# EasyEDA schematic SCH_cnc3018_upgrade_2024-04-28.json

## Sheets
1 Mainboard_Schematic: TITLE: Sheet_1; REV: 1.0; Date: 2024-04-21; Sheet: 1/1; Company: Your Company
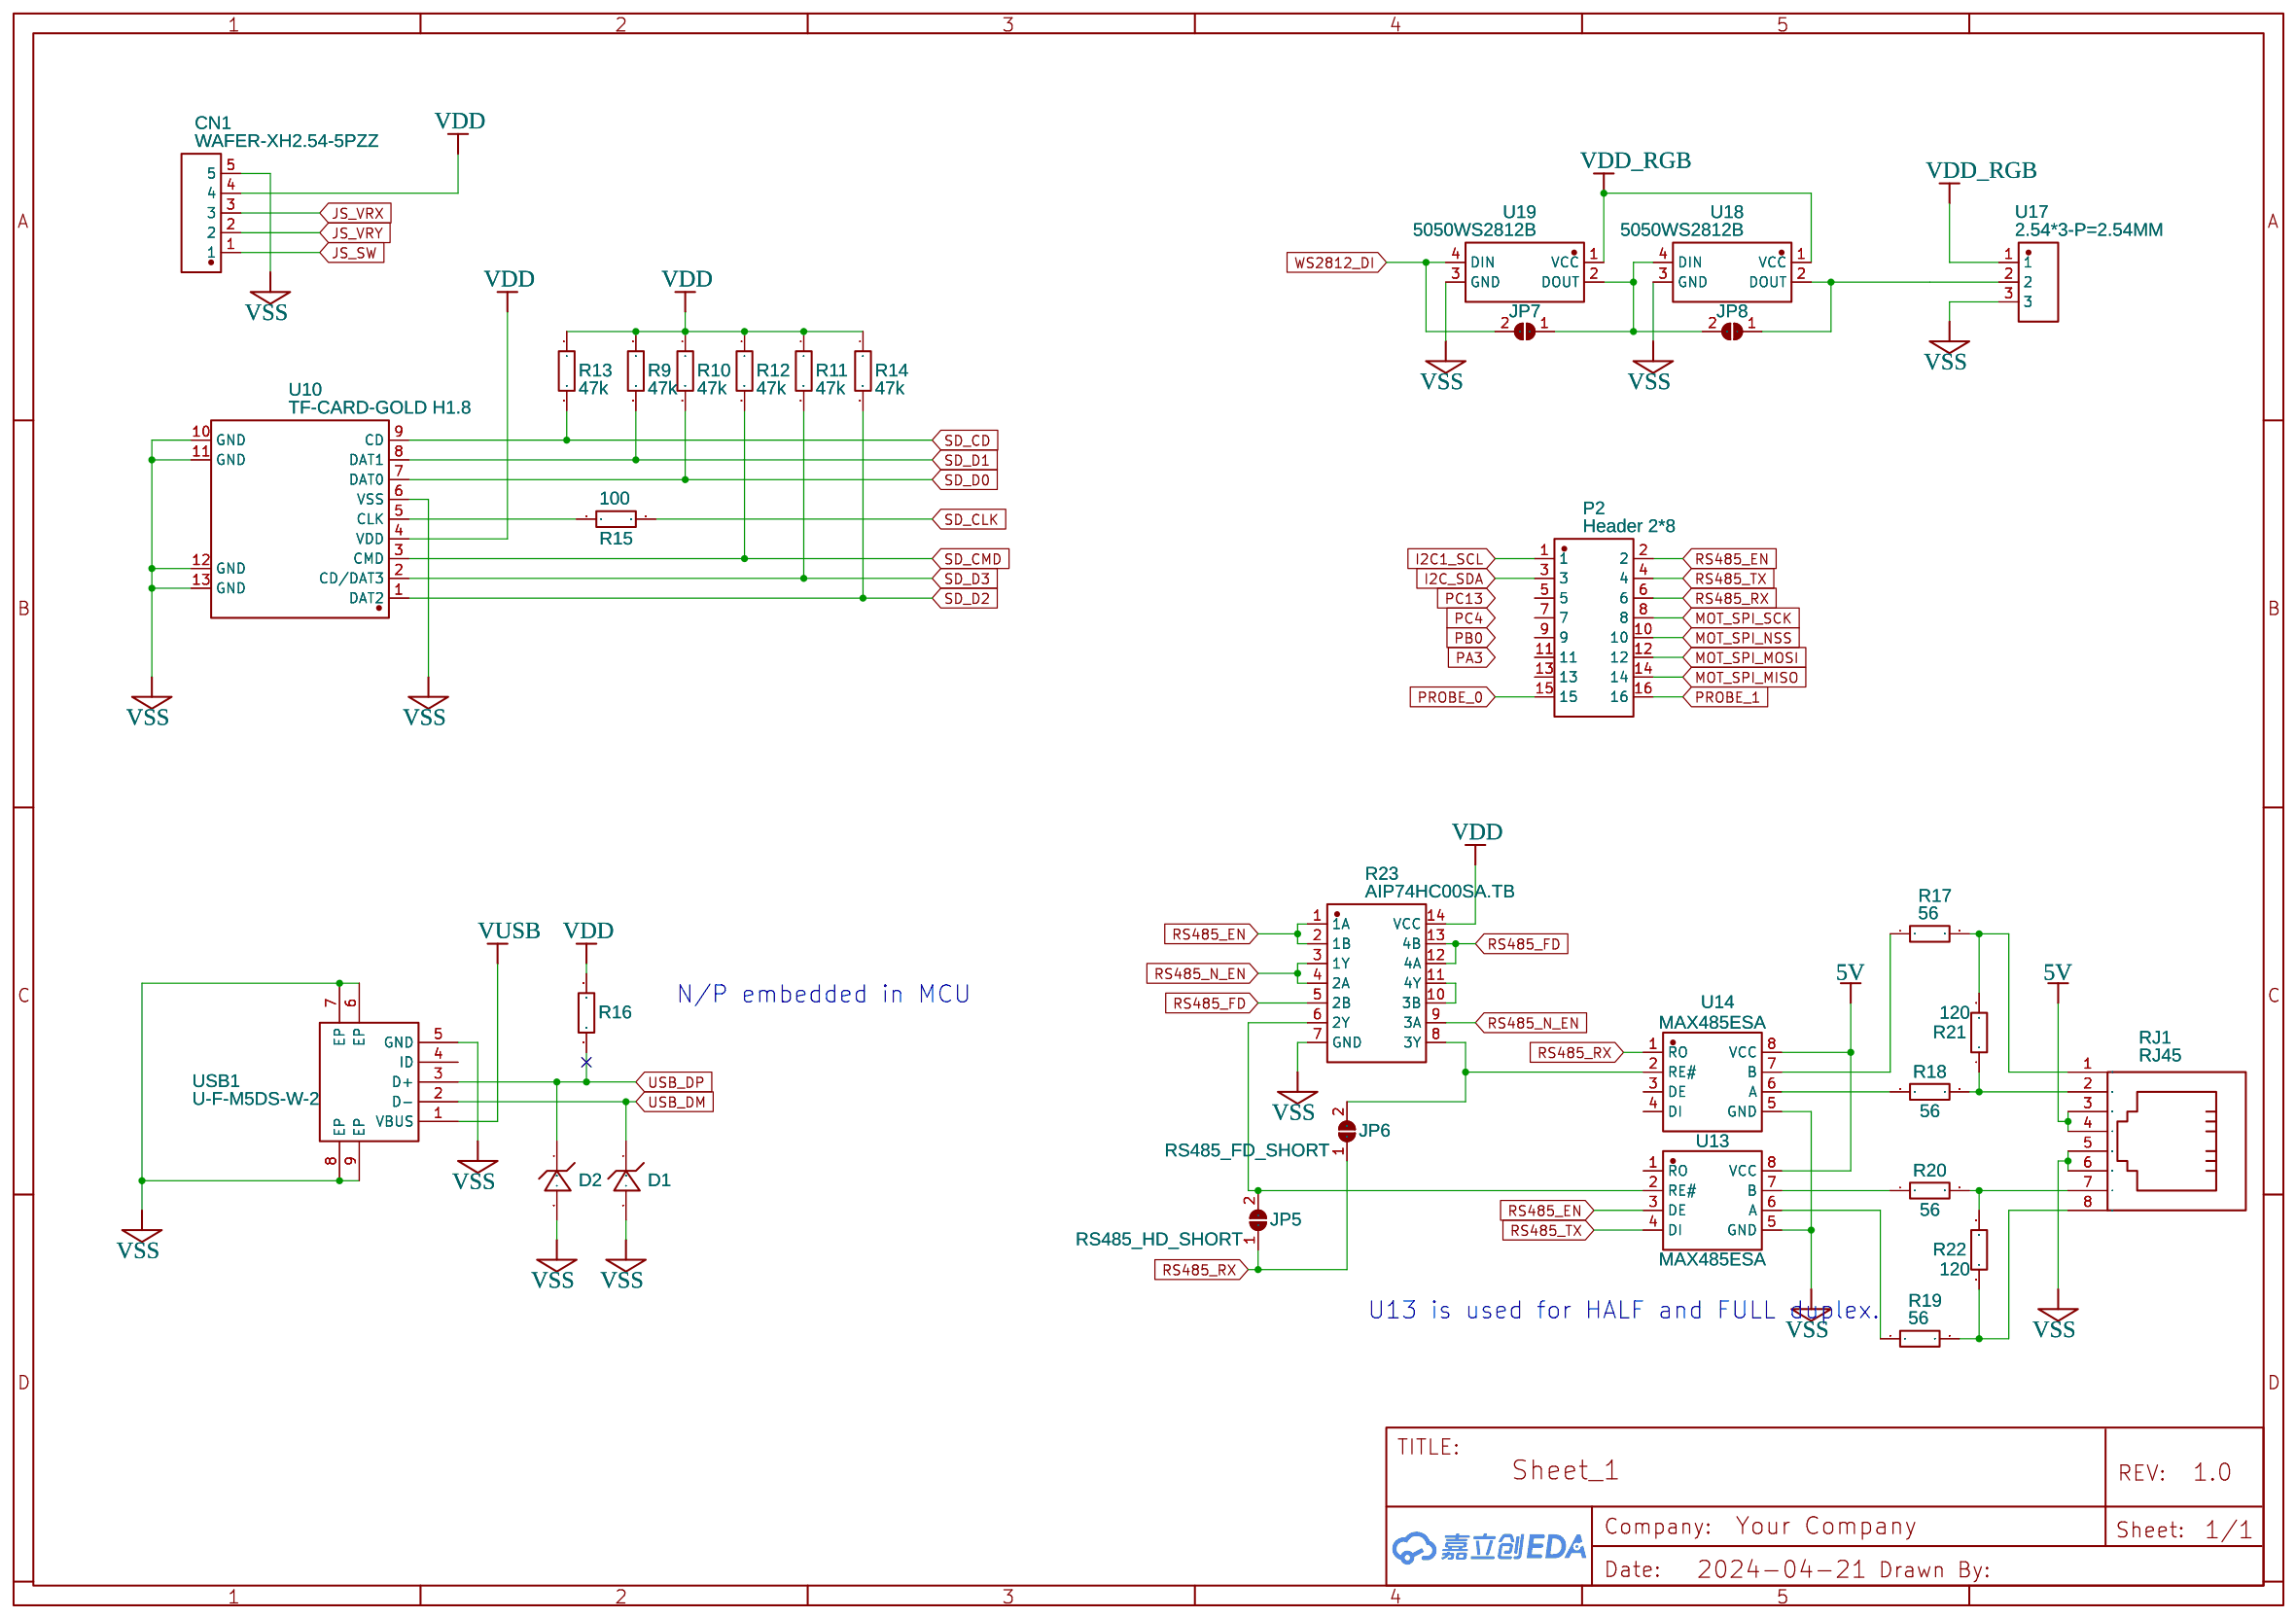
[diagram p0: Mainboard_Schematic]
2 MotorControl
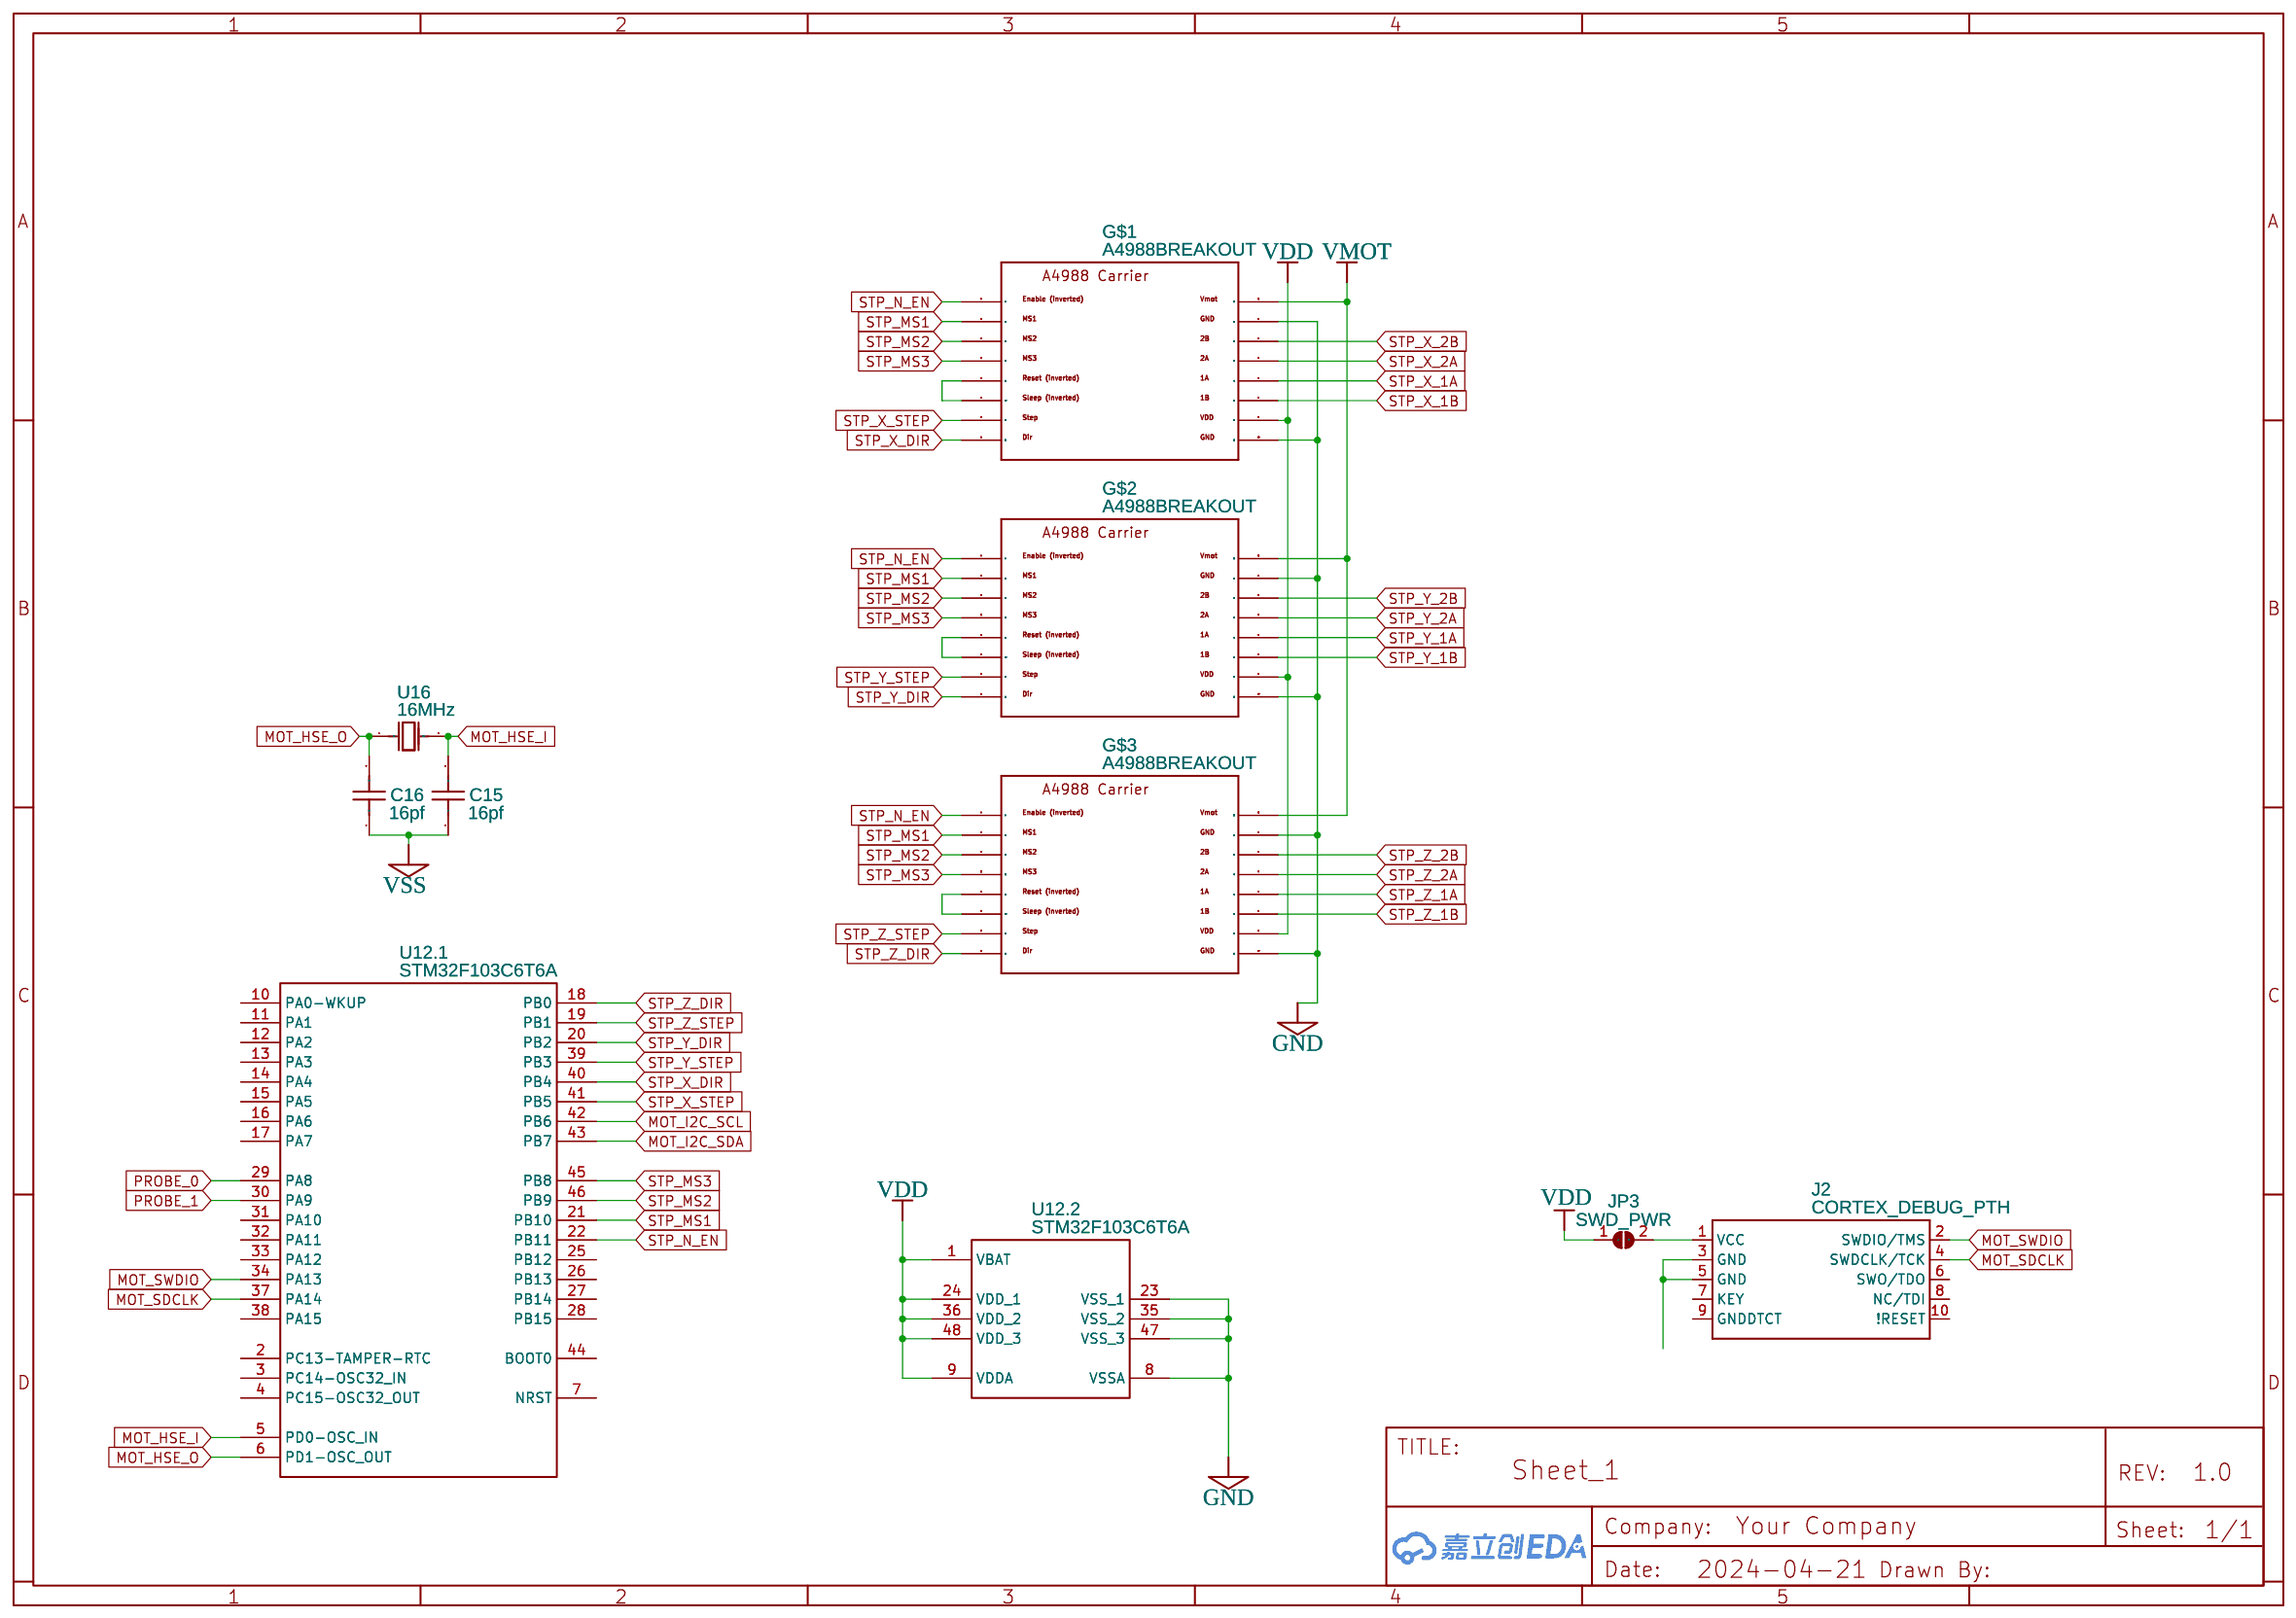
[diagram p1: MotorControl]
3 Processor: Date: 2024-04-22
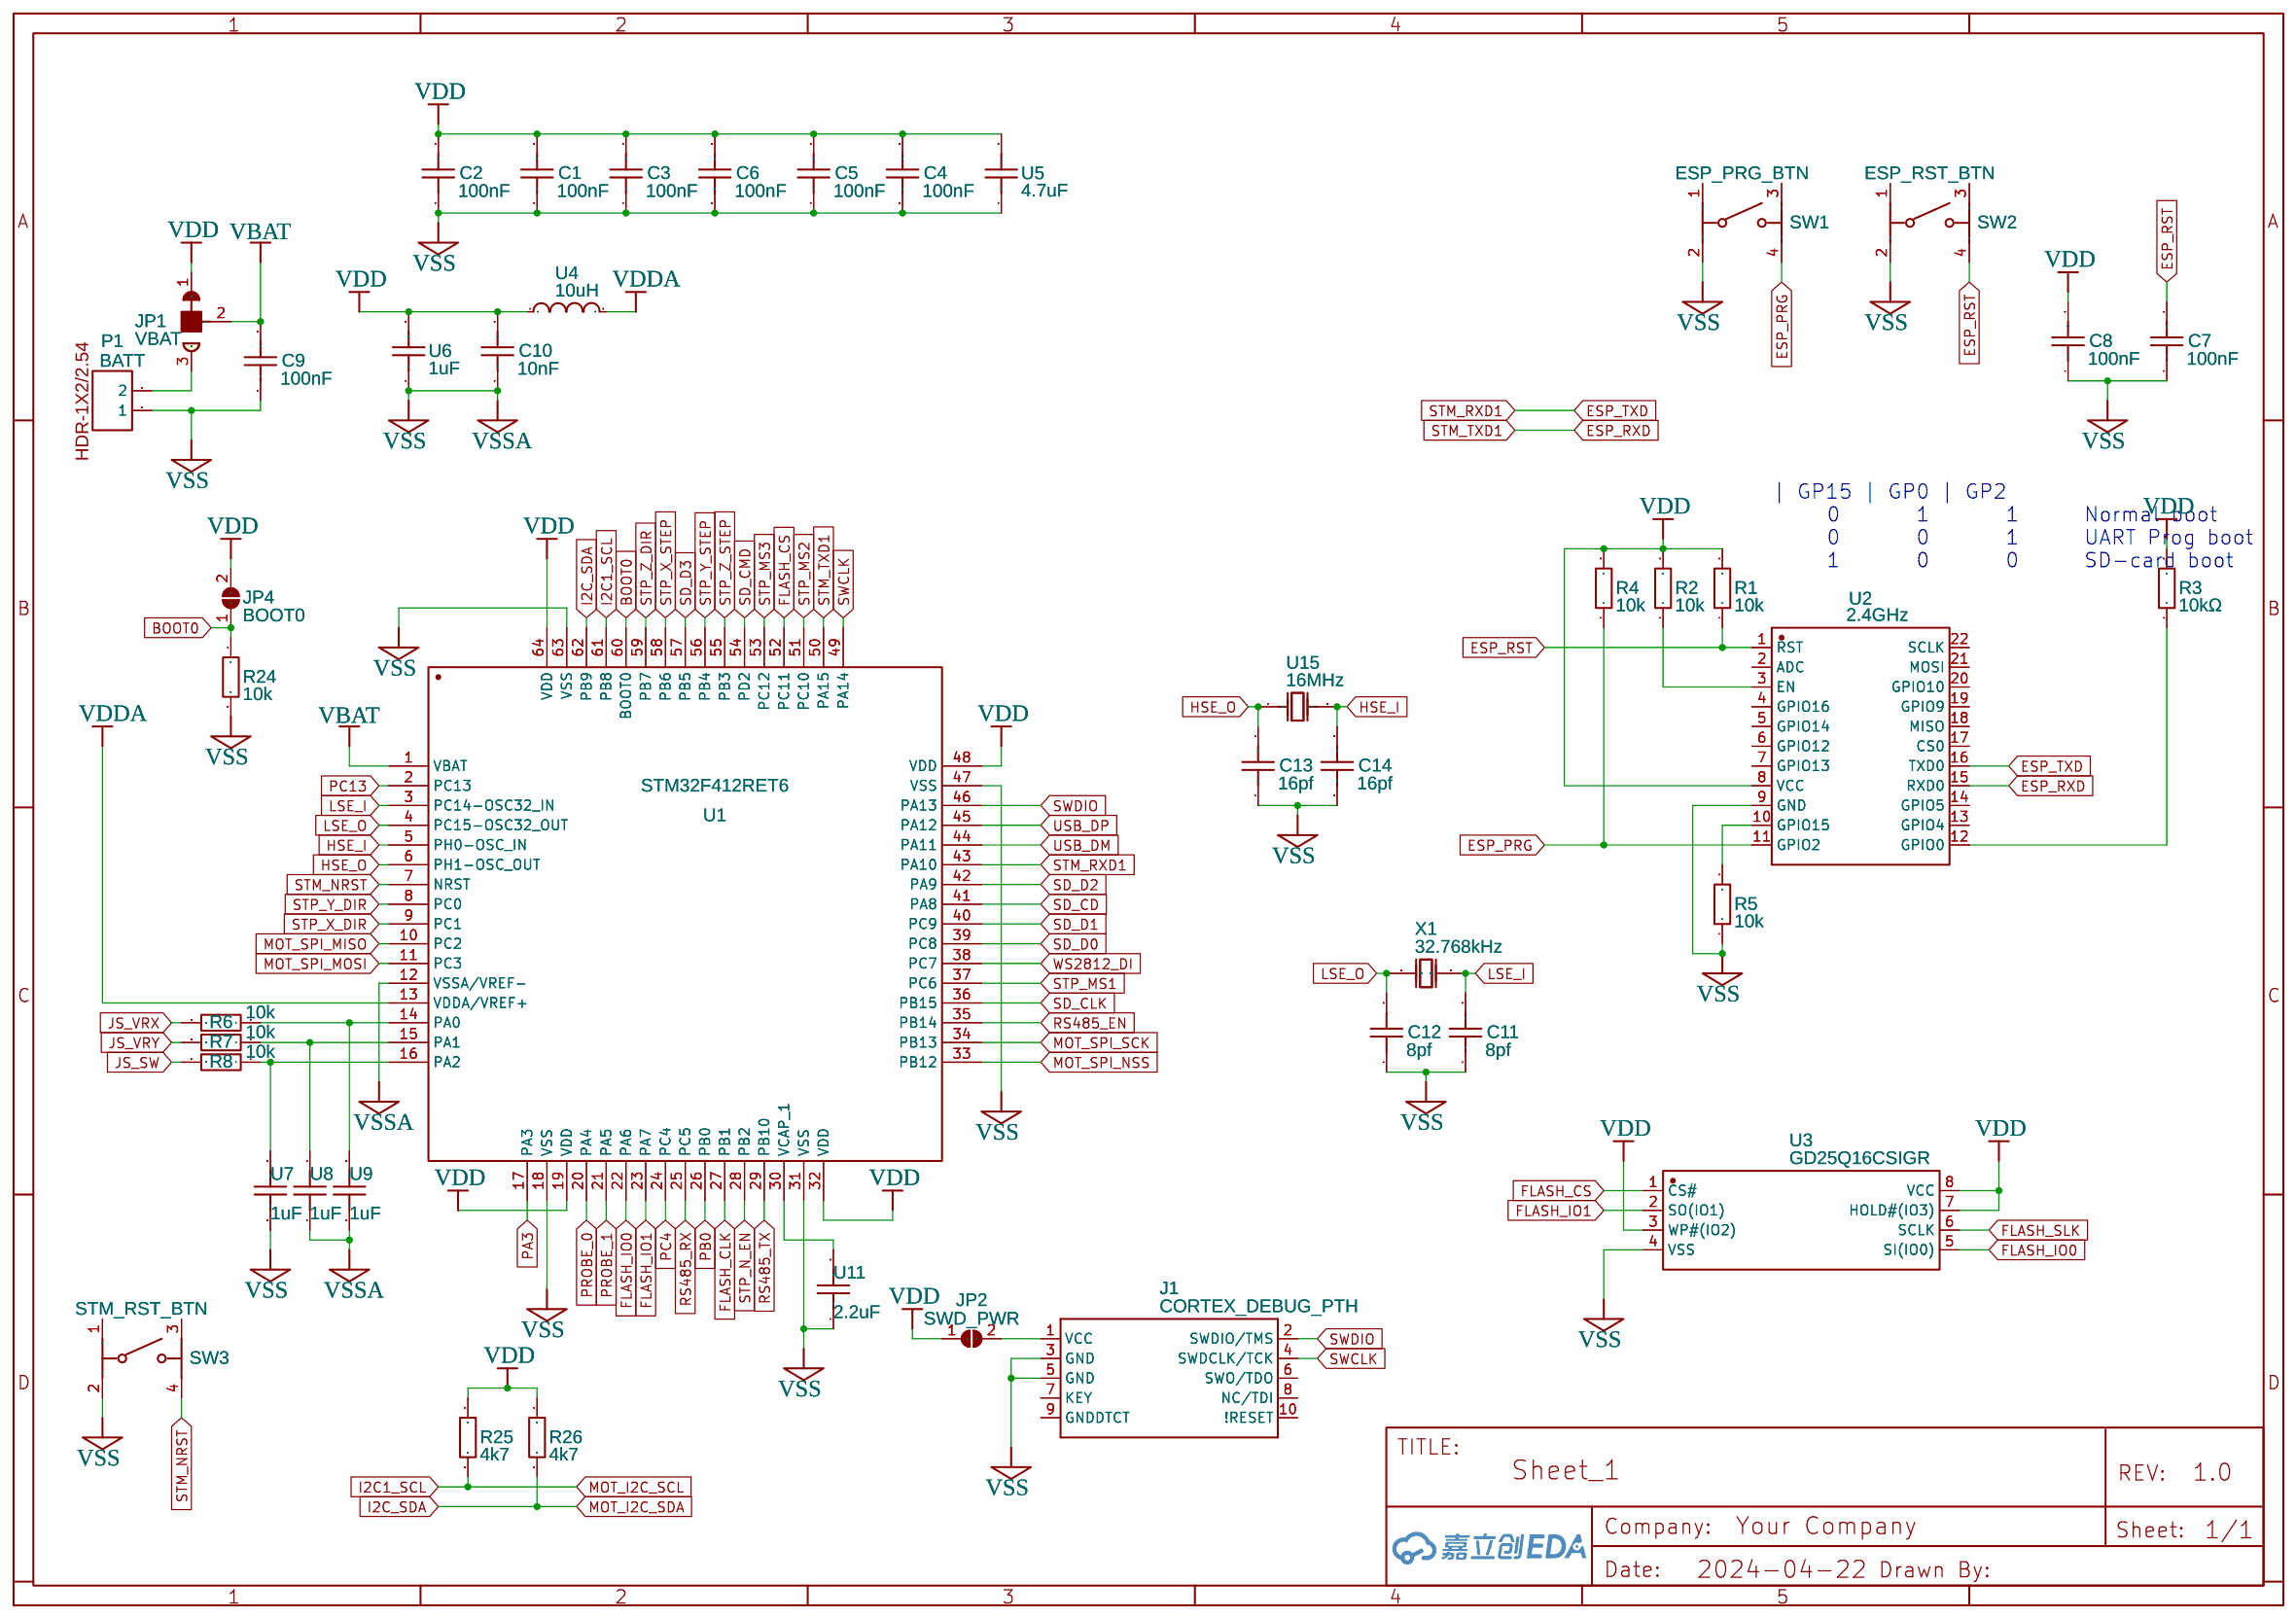
[diagram p2: Processor]

## Parts
sheet Mainboard_Schematic
CN1  WAFER-XH2.54-5PZZ  [CONN-TH_XH2.54-5P]
D1  SMAJ5.0A-TR  [SMA_L4.3-W2.6-LS5.2-RD]
D2  SMAJ5.0A-TR  [SMA_L4.3-W2.6-LS5.2-RD]
JP5  RS485_HD_SHORT  [SOLDER BRIDGE 2P UNBRIDGED]
JP6  RS485_FD_SHORT  [SOLDER BRIDGE 2P UNBRIDGED]
JP7  SHORT_2812_1  [SOLDER BRIDGE 2P UNBRIDGED]
JP8  SHORT_2812_2  [SOLDER BRIDGE 2P UNBRIDGED]
P2  Header 2*8  [HEADER-2X8]
R9  47k  [R1206]
R10  47k  [R1206]
R11  47k  [R1206]
R12  47k  [R1206]
R13  47k  [R1206]
R14  47k  [R1206]
R15  100  [R1206]
R16  10kΩ  [R1206]
R17  56  [R1206]
R18  56  [R1206]
R19  56  [R1206]
R20  56  [R1206]
R21  120  [R1206]
R22  120  [R1206]
R23  AIP74HC00SA.TB  [SOP-14_L8.7-W3.9-P1.27-LS6.0-BL]
RJ1  RJ45  [RJ45-TH-RWRCUSTOM-8P8C]
U10  TF-CARD-GOLD H1.8  [TF-SMD_TF-CARD-H1.8]
U13  MAX485ESA  [SOP-8_L4.9-W3.9-P1.27-LS6.0-BL]
U14  MAX485ESA  [SOP-8_L4.9-W3.9-P1.27-LS6.0-BL]
U17  2.54*3-P=2.54MM  [CONN-TH_XH2.54-3P]
U18  5050WS2812B  [LED-SMD_5050WS2812B]
U19  5050WS2812B  [LED-SMD_5050WS2812B]
USB1  U-F-M5DS-W-2  [MICRO-USB-SMD_MICRO-USB-A15]
sheet MotorControl
C15  16pf  [C0805]
C16  16pf  [C0805]
G$1  A4988BREAKOUT  [A4988BREAKOUT]
G$2  A4988BREAKOUT  [A4988BREAKOUT]
G$3  A4988BREAKOUT  [A4988BREAKOUT]
J2  CORTEX_DEBUG_PTH  [2X5-PTH-1.27MM]
JP3  SWD_PWR  [SOLDER BRIDGE 2P UNBRIDGED]
U12  STM32F103C6T6A  [LQFP-48_L7.0-W7.0-P0.50-LS9.0-BL]  (sections 1,2)
U16  16MHz  [CRYSTAL-SMD_L11.4-W4.7-LS12.7]
sheet Processor
C1  100nF  [C0805]
C2  100nF  [C0805]
C3  100nF  [C0805]
C4  100nF  [C0805]
C5  100nF  [C0805]
C6  100nF  [C0805]
C7  100nF  [C0805]
C8  100nF  [C0805]
C9  100nF  [C0805]
C10  10nF  [C0805]
C11  8pf  [C0805]
C12  8pf  [C0805]
C13  16pf  [C0805]
C14  16pf  [C0805]
J1  CORTEX_DEBUG_PTH  [2X5-PTH-1.27MM]
JP1  VBAT  [SOLDER_BRIDGE_3P_BRIDGED]
JP2  SWD_PWR  [SOLDER BRIDGE 2P UNBRIDGED]
JP4  BOOT0  [SOLDER BRIDGE 2P UNBRIDGED]
P1  BATT  [HDR-1X2/2.54]
R1  10k  [R1206]
R2  10k  [R1206]
R3  10kΩ  [R1206]
R4  10k  [R1206]
R5  10k  [R1206]
R6  10k  [R1206]
R7  10k  [R1206]
R8  10k  [R1206]
R24  10k  [R1206]
R25  4k7  [R1206]
R26  4k7  [R1206]
SW1  ESP_PRG_BTN  [SW-SMD_4P-L5.2-W5.2-P3.70-LS6.5]
SW2  ESP_RST_BTN  [SW-SMD_4P-L5.2-W5.2-P3.70-LS6.5]
SW3  STM_RST_BTN  [SW-SMD_4P-L5.2-W5.2-P3.70-LS6.5]
U1  STM32F412RET6  [LQFP-64_L10.0-W10.0-P0.50-LS12.0-BL]
U2  2.4GHz  [WIFIM-SMD_ESP-12F-ESP8266MOD]
U3  GD25Q16CSIGR  [SOP-8_L5.3-W5.3-P1.27-LS8.0-BL]
U4  10uH  [IND-TH_BD4.0-P5.00-D0.8]
U5  4.7uF  [C0805]
U6  1uF  [C0805]
U7  1uF  [C0805]
U8  1uF  [C0805]
U9  1uF  [C0805]
U11  2.2uF  [C0805]
U15  16MHz  [CRYSTAL-SMD_L11.4-W4.7-LS12.7]
X1  32.768kHz  [OSC-TH_BD2.0-P0.70-D0.3]

## Library data of the parts
CN1 = WAFER-XH2.54-5PZZ: Supplier: LCSC; Supplier Part: C5359633; Manufacturer: XUNPU(讯普); JLCPCB Part Class: Extended Part; Contributor: lcsc
D1 D2 = SMAJ5.0A-TR: Supplier: LCSC; Supplier Part: C98802; Manufacturer: STMicroelectronics; Contributor: us__007; SMT Type: Extend; JLCPCB SMD: Yes; LCSC Assembly: Yes; Paste Type: expand
JP2-JP8 = SOLDER BRIDGE: Contributor: Giovanni Lenzi
P2 = Header 2*8: Contributor: dippa
R1-R22 R24-R26 = RT1206BRD0710KL: Contributor: LCSC; Supplier: LCSC; Manufacturer: YAGEO(国巨); Supplier Part: C136889; JLCPCB Part Class: Extended Part
R23 = AIP74HC00SA.TB: Contributor: LCSC; Supplier: LCSC; Supplier Part: C2943283; Manufacturer: I-CORE(中微爱芯); JLCPCB Part Class: Extended Part
RJ1 = CUSTOM RJ45 FOOTPRINT: Supplier: LCSC; Supplier Part: C573036; Manufacturer: TE Connectivity(美国泰科); Manufacturer Part: 1888566-1; Contributor: LCSC; JLCPCB Part Class: Extended Part
U10 = TF-CARD-GOLD H1.8: Supplier: LCSC; Supplier Part: C7529390; Manufacturer: SHOU HAN(首韩); Manufacturer Part: TF-CARD-Gold H1.8; Contributor: lcsc
U13 U14 = MAX485ESA: Contributor: LCSC; Supplier: LCSC; Supplier Part: C2687394; Manufacturer: JSMSEMI(杰盛微); Manufacturer Part: max485ESA; JLCPCB Part Class: Extended Part
U17 = 2.54*3-P=2.54MM: Contributor: LCSC; Supplier: LCSC; Supplier Part: C9900005597; Manufacturer: null; Manufacturer Part: 2.54*3-P=2.54mm
U18 U19 = 5050WS2812B: Contributor: LCSC; Supplier: LCSC; Supplier Part: C2874876; Manufacturer: null; JLCPCB Part Class: Extended Part
USB1 = U-F-M5DS-W-2: Contributor: LCSC; Supplier: LCSC; Manufacturer: 韩国韩荣; Supplier Part: C145789; JLCPCB Part Class: Extended Part
C1-C16 = AC0805KRX7R8BB104: Contributor: LCSC; Supplier: LCSC; Supplier Part: C726591; Manufacturer: YAGEO; JLCPCB Part Class: Extended Part
G$1-G$3 = A4988BREAKOUT: Contributor: KiwiDust
J1 J2 = CORTEX_DEBUG_PTH: Contributor: osirisizs
U12 = STM32F103C6T6A: tags: STM32; subpart_no: 1; Supplier Part: C8303; Supplier: LCSC; Manufacturer: ST(意法半导体); JLCPCB Part Class: Extended Part
U15 U16 = ABLS-16.000MHZ-D-3-Y-T: Contributor: LCSC; Supplier: LCSC; Supplier Part: C1986582; Manufacturer: ABRACON; JLCPCB Part Class: Extended Part
JP1 = SOLDER BRIDGE: Contributor: softmachine
P1 = Header-Female-2.54_1x2: Supplier: LCSC; Manufacturer: BOOMELE; Manufacturer Part: 2.54-1*2PFemale; image: //image.lceda.cn/szlcsc/C49661.jpg; Supplier Part: C49661; Package Display: Yes; Contributor: Scikraft
SW1-SW3 = Button-SMD-4x4x1.5: Supplier Part: C71830; Supplier: LCSC; Manufacturer: BBJ; Manufacturer Part: 4*4*1.5Copper head,260G, 0.25mm,
U1 = STM32F412RET6: Contributor: LCSC; Supplier: LCSC; Manufacturer: ST(意法半导体); Supplier Part: C89374; JLCPCB Part Class: Extended Part; Package Display: No
U2 = ESP-12F(ESP8266MOD): Supplier: LCSC; Manufacturer: Ai-Thinker(安信可); Supplier Part: C82891; JLCPCB Part Class: Extended Part
U3 = GD25Q16CSIGR: Contributor: LCSC; Supplier: LCSC; Supplier Part: C395505; Manufacturer: GigaDevice(兆易创新); JLCPCB Part Class: Extended Part
U4 = B78148S1103K009: Contributor: lcsc; Supplier: LCSC; Supplier Part: C1333529; Manufacturer: TDK; JLCPCB Part Class: Extended Part
U5-U9 U11 = TCC0805X5R475M250FT: Supplier: LCSC; Supplier Part: C5375826; Manufacturer: CCTC(三环); JLCPCB Part Class: Extended Part; Contributor: lcsc
X1 = DT-26-32.768K-6PF-20PPM: Contributor: LCSC; Supplier: LCSC; Supplier Part: C127496; Manufacturer: KDS(大真空); Manufacturer Part: DT-26-32.768K 6pF 20PPM; JLCPCB Part Class: Extended Part

## Nets
5V: RJ1.3 RJ1.4 U13.8(VCC) U14.8(VCC)
GND: G$1.GND G$1.GND@0(GND) G$2.GND G$2.GND@0(GND) G$3.GND G$3.GND@0(GND) U12.8(VSSA) U12.23(VSS_1) U12.35(VSS_2) U12.47(VSS_3)
VBAT: C9.2 JP1.2 U1.1(VBAT)
VDD: C1.2 C2.2 C3.2 C4.2 C5.2 C6.2 C8.2 C10.2 CN1.4 G$1.VDD G$2.VDD G$3.VDD JP1.1 JP2.1(A) JP3.1(A) JP4.2(B) R1.2 R2.2 R3.2 R4.2 R9.1 R10.1 R11.1 R12.1 R13.1 R14.1 R16.2 R23.14(VCC) R25.1 R26.1 U1.19(VDD) U1.32(VDD) U1.48(VDD) U1.64(VDD) U2.8(VCC) U3.3(WP#(IO2)) U3.7(HOLD#(IO3)) U3.8(VCC) U4.1 U5.2 U6.2 U10.4(VDD) U12.1(VBAT) U12.9(VDDA) U12.24(VDD_1) U12.36(VDD_2) U12.48(VDD_3)
VDD_RGB: U17.1 U18.1(VCC) U19.1(VCC)
VDDA: U1.13(VDDA/VREF+) U4.2
VSS: C1.1 C2.1 C3.1 C4.1 C5.1 C6.1 C7.1 C8.1 C9.1 C10.1 C11.1 C12.1 C13.1 C14.1 C15.1 C16.1 CN1.5 D1.2(A) D2.2(A) J1.3(GND) J1.5(GND) P1.1 R5.1 R23.7(GND) R24.2 RJ1.5 RJ1.6 SW1.2 SW2.2 SW3.2 U1.12(VSSA/VREF-) U1.18(VSS) U1.31(VSS) U1.47(VSS) U1.63(VSS) U2.9(GND) U3.4(VSS) U5.1 U6.1 U7.1 U8.1 U9.1 U10.6(VSS) U10.10(GND) U10.11(GND) U10.12(GND) U10.13(GND) U11.1 U13.5(GND) U14.5(GND) U17.3 U18.3(GND) U19.3(GND) USB1.5(GND) USB1.6(EP) USB1.7(EP) USB1.8(EP) USB1.9(EP)
BOOT0: JP4.1(A) R24.1 U1.60(BOOT0)
ESP_PRG: R4.1 SW1.4 U2.11(GPIO2)
ESP_RST: C7.2 R1.1 SW2.4 U2.1(RST)
ESP_RXD: U1.50(PA15) U2.15(RXD0)
ESP_TXD: U1.43(PA10) U2.16(TXD0)
FLASH_CLK: U1.27(PB1)
FLASH_CS: U1.52(PC11) U3.1(CS#)
FLASH_IO0: U1.22(PA6) U3.5(SI(IO0))
FLASH_IO1: U1.23(PA7) U3.2(SO(IO1))
FLASH_SLK: U3.6(SCLK)
HSE_I: C14.2 U1.5(PH0-OSC_IN) U15.2(OSC2)
HSE_O: C13.2 U1.6(PH1-OSC_OUT) U15.1(OSC1)
I2C1_SCL: P2.1 R25.2 U1.61(PB8) U12.42(PB6)
I2C_SDA: P2.3 R26.2 U1.62(PB9) U12.43(PB7)
JS_SW: CN1.1 R8.2
JS_VRX: CN1.3 R6.2
JS_VRY: CN1.2 R7.2
LSE_I: C11.2 U1.3(PC14-OSC32_IN) X1.2(OSC2)
LSE_O: C12.2 U1.4(PC15-OSC32_OUT) X1.1(OSC1)
MOT_HSE_I: C15.2 U12.5(PD0-OSC_IN) U16.2(OSC2)
MOT_HSE_O: C16.2 U12.6(PD1-OSC_OUT) U16.1(OSC1)
MOT_SDCLK: J2.4(SWDCLK/TCK) U12.37(PA14)
MOT_SPI_MISO: P2.14 U1.10(PC2)
MOT_SPI_MOSI: P2.12 U1.11(PC3)
MOT_SPI_NSS: P2.10 U1.33(PB12)
MOT_SPI_SCK: P2.8 U1.34(PB13)
MOT_SWDIO: J2.2(SWDIO/TMS) U12.34(PA13)
PA3: U1.17(PA3)
PB0: U1.26(PB0)
PC4: U1.24(PC4)
PC13: U1.2(PC13)
PROBE_0: P2.15 U1.20(PA4) U12.29(PA8)
PROBE_1: P2.16 U1.21(PA5) U12.30(PA9)
RS485_EN: P2.2 R23.1(1A) R23.2(1B) U1.35(PB14) U13.3(DE)
RS485_FD: R23.5(2B) R23.12(4A) R23.13(4B)
RS485_N_EN: R23.3(1Y) R23.4(2A) R23.9(3A)
RS485_RX: JP5.1(A) JP6.1(A) P2.6 U1.25(PC5) U14.1(RO)
RS485_TX: P2.4 U1.29(PB10) U13.4(DI)
SD_CD: R13.2 U1.41(PA8) U10.9(CD)
SD_CLK: R15.2 U1.36(PB15)
SD_CMD: R12.2 U1.54(PD2) U10.3(CMD)
SD_D0: R10.2 U1.39(PC8) U10.7(DAT0)
SD_D1: R9.2 U1.40(PC9) U10.8(DAT1)
SD_D2: R14.2 U1.42(PA9) U10.1(DAT2)
SD_D3: R11.2 U1.57(PB5) U10.2(CD/DAT3)
STM_NRST: SW3.4 U1.7(NRST)
STP_MS1: G$1.MS1 G$2.MS1 G$3.MS1 U1.37(PC6) U12.21(PB10)
STP_MS2: G$1.MS2 G$2.MS2 G$3.MS2 U1.51(PC10) U12.46(PB9)
STP_MS3: G$1.MS3 G$2.MS3 G$3.MS3 U1.53(PC12) U12.45(PB8)
STP_N_EN: G$1.EN G$2.EN G$3.EN U1.28(PB2) U12.22(PB11)
STP_X_1A: G$1.1A
STP_X_1B: G$1.1B
STP_X_2A: G$1.2A
STP_X_2B: G$1.2B
STP_X_DIR: G$1.DIR U1.9(PC1) U12.40(PB4)
STP_X_STEP: G$1.STEP U1.58(PB6) U12.41(PB5)
STP_Y_1A: G$2.1A
STP_Y_1B: G$2.1B
STP_Y_2A: G$2.2A
STP_Y_2B: G$2.2B
STP_Y_DIR: G$2.DIR U1.8(PC0) U12.20(PB2)
STP_Y_STEP: G$2.STEP U1.56(PB4) U12.39(PB3)
STP_Z_1A: G$3.1A
STP_Z_1B: G$3.1B
STP_Z_2A: G$3.2A
STP_Z_2B: G$3.2B
STP_Z_DIR: G$3.DIR U1.59(PB7) U12.18(PB0)
STP_Z_STEP: G$3.STEP U1.55(PB3) U12.19(PB1)
SWCLK: J1.4(SWDCLK/TCK) U1.49(PA14)
SWDIO: J1.2(SWDIO/TMS) U1.46(PA13)
USB_DM: D1.1(C) U1.44(PA11) USB1.2(D-)
USB_DP: D2.1(C) R16.1 U1.45(PA12) USB1.3(D+)
VMOT: G$1.VMOT G$2.VMOT G$3.VMOT
VUSB: USB1.1(VBUS)
WS2812_DI: JP7.2(B) U1.38(PC7) U19.4(DIN)
Net-(G$1-RST): G$1.RST G$1.SLP(SLEEP)
Net-(G$2-RST): G$2.RST G$2.SLP(SLEEP)
Net-(G$3-RST): G$3.RST G$3.SLP(SLEEP)
Net-(J1-1): J1.1(VCC) JP2.2(B)
Net-(J2-1): J2.1(VCC) JP3.2(B)
Net-(J2-3): J2.3(GND) J2.5(GND)
Net-(JP1-3): JP1.3 P1.2
Net-(JP5-2): JP5.2(B) R23.6(2Y) U13.2(RE#)
Net-(JP6-2): JP6.2(B) R23.8(3Y) U14.2(RE#)
Net-(JP7-1): JP7.1(A) JP8.2(B) U18.4(DIN) U19.2(DOUT)
Net-(JP8-1): JP8.1(A) U17.2 U18.2(DOUT)
Net-(R2-1): R2.1 U2.3(EN)
Net-(R3-1): R3.1 U2.12(GPIO0)
Net-(R5-2): R5.2 U2.10(GPIO15)
Net-(R6-1): R6.1 U1.14(PA0) U9.2
Net-(R7-1): R7.1 U1.15(PA1) U8.2
Net-(R8-1): R8.1 U1.16(PA2) U7.2
Net-(R15-1): R15.1 U10.5(CLK)
Net-(R17-1): R17.1 U14.7(B)
Net-(R17-2): R17.2 R21.2 RJ1.1
Net-(R18-1): R18.1 U14.6(A)
Net-(R18-2): R18.2 R21.1 RJ1.2
Net-(R19-1): R19.1 U13.6(A)
Net-(R19-2): R19.2 R22.1 RJ1.8
Net-(R20-1): R20.1 U13.7(B)
Net-(R20-2): R20.2 R22.2 RJ1.7
Net-(R23-10): R23.10(3B) R23.11(4Y)
Net-(U1-30): U1.30(VCAP_1) U11.2

Not connected (* = marked no-connect by the designer): J1 6(SWO/TDO) 7(KEY) 8(NC/TDI) 9(GNDDTCT) 10(!RESET); J2 6(SWO/TDO) 7(KEY) 8(NC/TDI) 9(GNDDTCT) 10(!RESET); P2 5 7 9 11 13; SW1 1 3; SW2 1 3; SW3 1 3; U2 2(ADC) 4(GPIO16) 5(GPIO14) 6(GPIO12) 7(GPIO13) 13(GPIO4) 14(GPIO5) 17(CS0) 18(MISO) 19(GPIO9) 20(GPIO10) 21(MOSI) 22(SCLK); U12 2(PC13-TAMPER-RTC) 3(PC14-OSC32_IN) 4(PC15-OSC32_OUT) 7(NRST) 10(PA0-WKUP) 11(PA1) 12(PA2) 13(PA3) 14(PA4) 15(PA5) 16(PA6) 17(PA7) 25(PB12) 26(PB13) 27(PB14) 28(PB15) 31(PA10) 32(PA11) 33(PA12) 38(PA15) 44(BOOT0); U13 1(RO); U14 3(DE) 4(DI); USB1 4(ID)

## Notes on the sheets
sheet 1
- N/P embedded in MCU
- U13 is used for HALF and FULL duplex.
sheet 3
- | GP15 | GP0 | GP2
       0       1       1      Normal boot
       0       0       1      UART Prog boot
       1       0       0      SD-card boot
